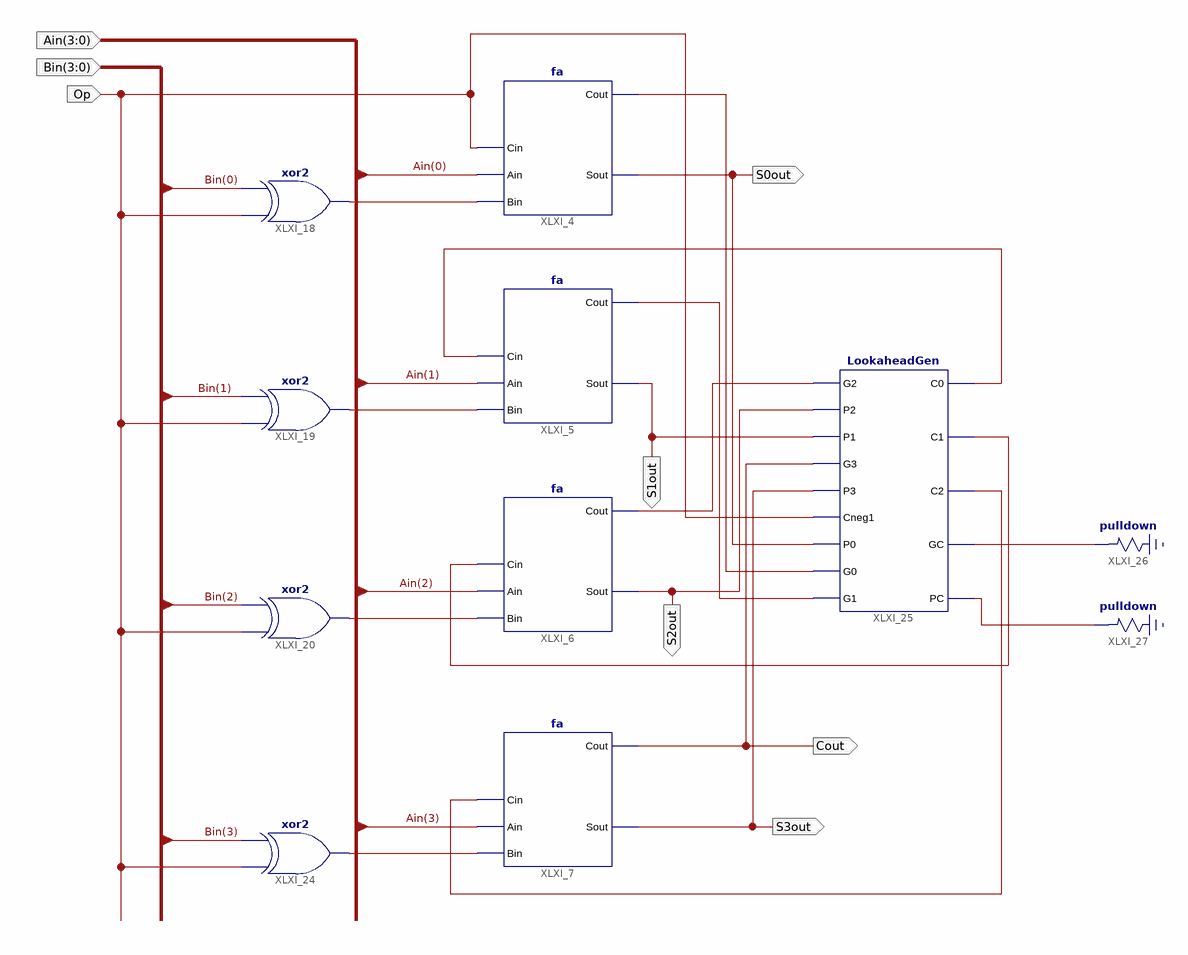
[diagram p0: schematic sheet 1]
// Xilinx ISE schematic FA4b.sch (spartan3e) as structural Verilog: 11 symbols, 8 ports
module FA4b (
  input  [3:0] Bin,
  input  [3:0] Ain,
  input  Op,
  output S0out,
  output S1out,
  output S2out,
  output S3out,
  output Cout
);

  wire XLXN_56, XLXN_57, XLXN_58, XLXN_85, XLXN_87, XLXN_89, XLXN_91, XLXN_92, XLXN_93, XLXN_94, XLXN_97,
       XLXN_98;

  fa XLXI_4 (.Cin(Op), .Cout(XLXN_87), .Ain(Ain[0]), .Bin(XLXN_57), .Sout(S0out));
  fa XLXI_5 (.Cin(XLXN_92), .Cout(XLXN_89), .Ain(Ain[1]), .Bin(XLXN_56), .Sout(S1out));
  fa XLXI_6 (.Cin(XLXN_93), .Cout(XLXN_91), .Ain(Ain[2]), .Bin(XLXN_58), .Sout(S2out));
  fa XLXI_7 (.Cin(XLXN_94), .Cout(Cout), .Ain(Ain[3]), .Bin(XLXN_85), .Sout(S3out));
  xor XLXI_18 (XLXN_57, Op, Bin[0]);
  xor XLXI_19 (XLXN_56, Op, Bin[1]);
  xor XLXI_20 (XLXN_58, Op, Bin[2]);
  xor XLXI_24 (XLXN_85, Op, Bin[3]);
  LookaheadGen XLXI_25 (
    .G2(XLXN_91), .P2(S2out), .P1(S1out), .G3(Cout), .P3(S3out), .Cneg1(Op), .P0(S0out), .G0(XLXN_87),
    .G1(XLXN_89), .C0(XLXN_92), .C1(XLXN_93), .C2(XLXN_94), .GC(XLXN_97), .PC(XLXN_98));
  \pulldown  XLXI_26 (.O(XLXN_97));
  \pulldown  XLXI_27 (.O(XLXN_98));
endmodule
